# Altium schematic sheet Busbar.SchDoc
size A2; SheetNumber: 1; SheetTotal: 1
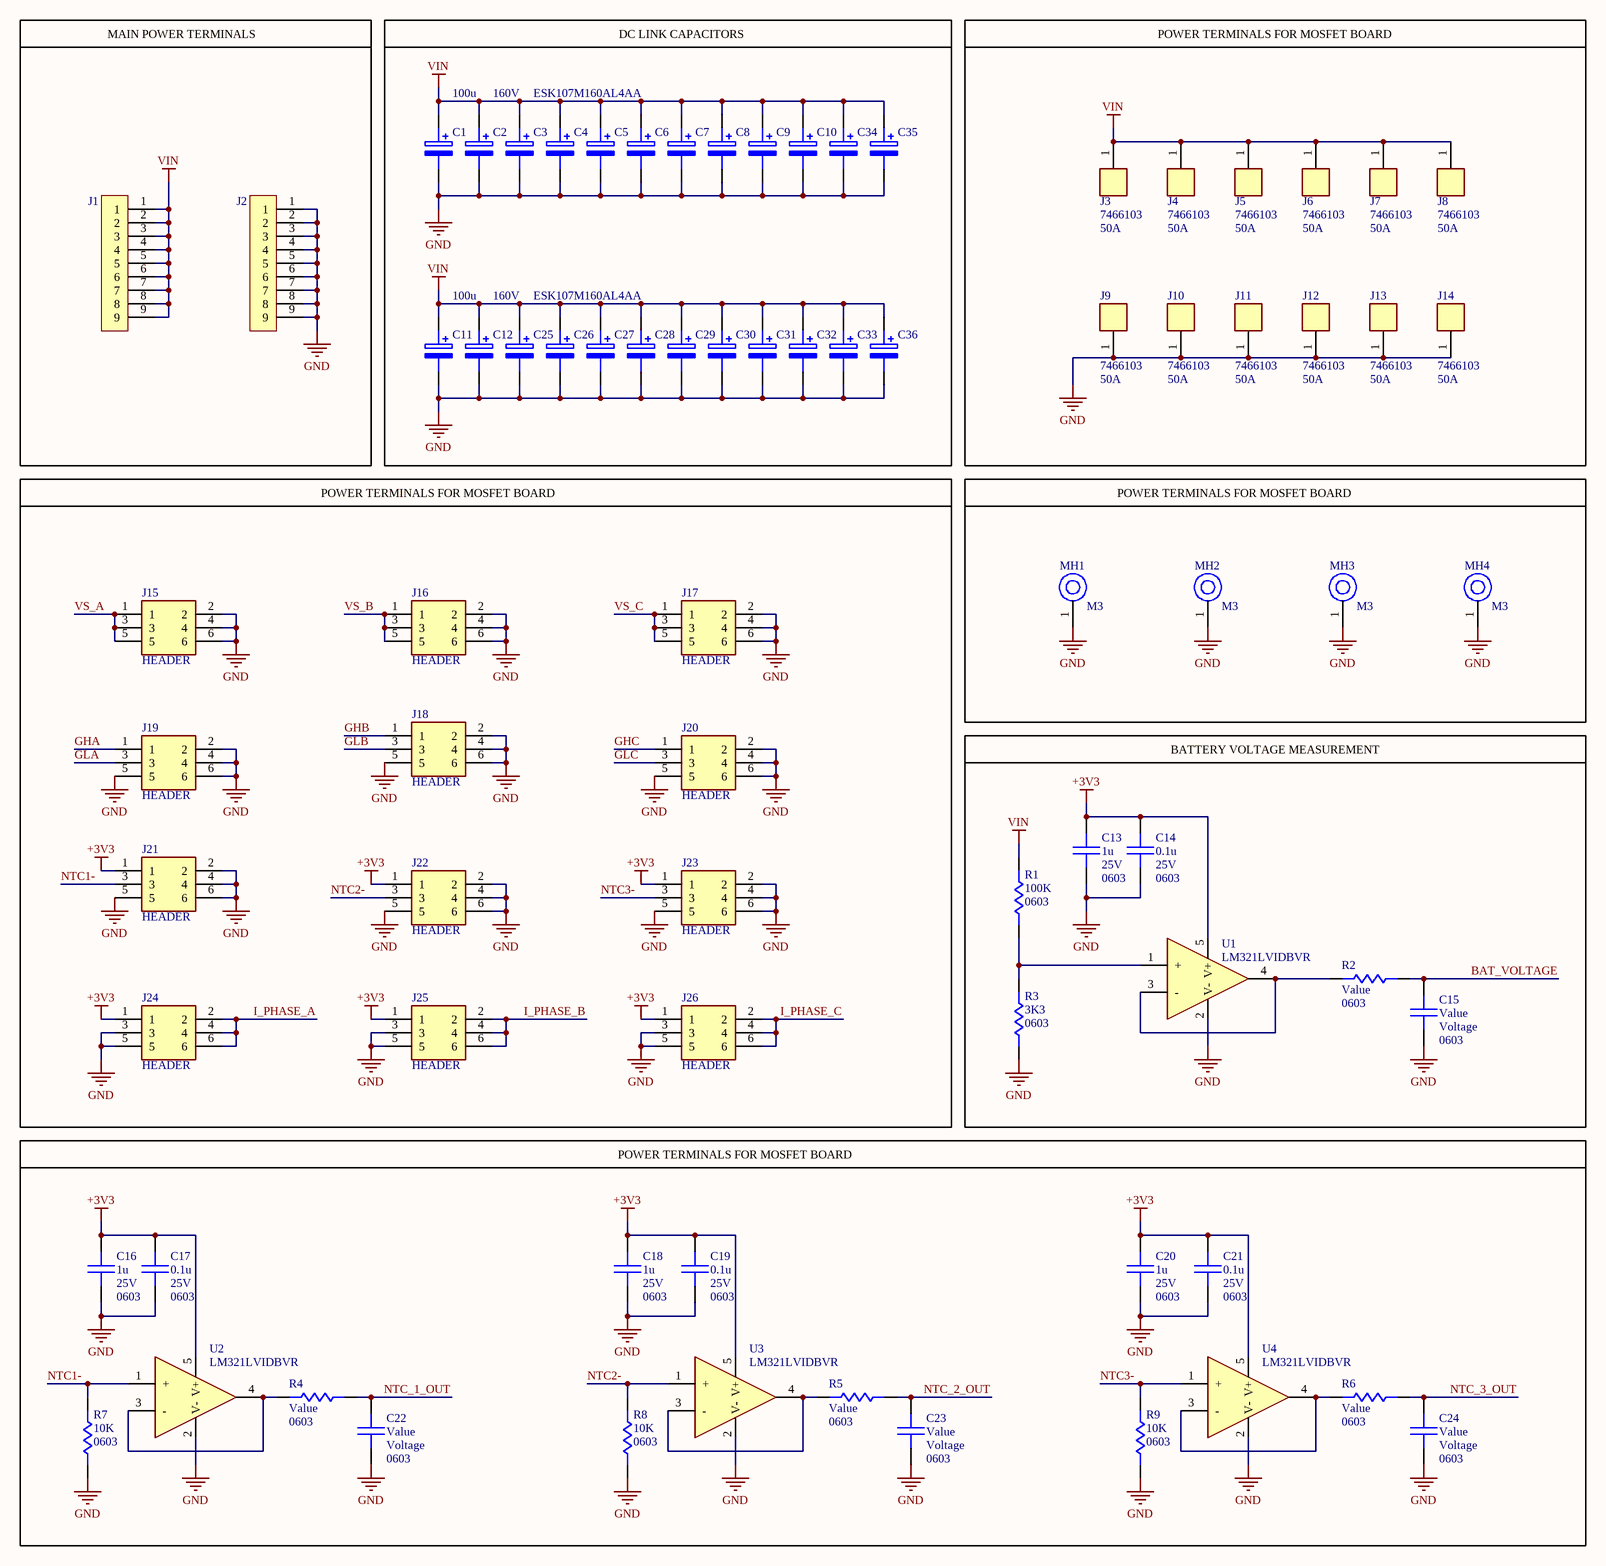
[diagram p0: Busbar.SchDoc]

## Parts
C1  ESK107M160AL4AA  value 100u  Voltage: 160V  [C_THT_13X25X5]
C2  ESK107M160AL4AA  [C_THT_13X25X5]  (value not drawn)
C3  ESK107M160AL4AA  [C_THT_13X25X5]  (value not drawn)
C4  ESK107M160AL4AA  [C_THT_13X25X5]  (value not drawn)
C5  ESK107M160AL4AA  [C_THT_13X25X5]  (value not drawn)
C6  ESK107M160AL4AA  [C_THT_13X25X5]  (value not drawn)
C7  ESK107M160AL4AA  [C_THT_13X25X5]  (value not drawn)
C8  ESK107M160AL4AA  [C_THT_13X25X5]  (value not drawn)
C9  ESK107M160AL4AA  [C_THT_13X25X5]  (value not drawn)
C10  ESK107M160AL4AA  [C_THT_13X25X5]  (value not drawn)
C11  ESK107M160AL4AA  value 100u  Voltage: 160V  [C_THT_13X25X5]
C12  ESK107M160AL4AA  [C_THT_13X25X5]  (value not drawn)
C13  0603  value 1u  Voltage: 25V  [C_0603]
C14  0603  value 0.1u  Voltage: 25V  [C_0603]
C15  0603  [C_0603]
C16  0603  value 1u  Voltage: 25V  [C_0603]
C17  0603  value 0.1u  Voltage: 25V  [C_0603]
C18  0603  value 1u  Voltage: 25V  [C_0603]
C19  0603  value 0.1u  Voltage: 25V  [C_0603]
C20  0603  value 1u  Voltage: 25V  [C_0603]
C21  0603  value 0.1u  Voltage: 25V  [C_0603]
C22  0603  [C_0603]
C23  0603  [C_0603]
C24  0603  [C_0603]
C25  ESK107M160AL4AA  [C_THT_13X25X5]  (value not drawn)
C26  ESK107M160AL4AA  [C_THT_13X25X5]  (value not drawn)
C27  ESK107M160AL4AA  [C_THT_13X25X5]  (value not drawn)
C28  ESK107M160AL4AA  [C_THT_13X25X5]  (value not drawn)
C29  ESK107M160AL4AA  [C_THT_13X25X5]  (value not drawn)
C30  ESK107M160AL4AA  [C_THT_13X25X5]  (value not drawn)
C31  ESK107M160AL4AA  [C_THT_13X25X5]  (value not drawn)
C32  ESK107M160AL4AA  [C_THT_13X25X5]  (value not drawn)
C33  ESK107M160AL4AA  [C_THT_13X25X5]  (value not drawn)
C34  ESK107M160AL4AA  [C_THT_13X25X5]  (value not drawn)
C35  ESK107M160AL4AA  [C_THT_13X25X5]  (value not drawn)
C36  ESK107M160AL4AA  [C_THT_13X25X5]  (value not drawn)
J1  74651195R  [74651195R]  (value not drawn)
J2  74651195R  [74651195R]  (value not drawn)
J3  7466103  Current: 50A  [PAD_D8.2_H3.4]
J4  7466103  Current: 50A  [PAD_D8.2_H3.4]
J5  7466103  Current: 50A  [PAD_D8.2_H3.4]
J6  7466103  Current: 50A  [PAD_D8.2_H3.4]
J7  7466103  Current: 50A  [PAD_D8.2_H3.4]
J8  7466103  Current: 50A  [PAD_D8.2_H3.4]
J9  7466103  Current: 50A  [PAD_D8.2_H3.4]
J10  7466103  Current: 50A  [PAD_D8.2_H3.4]
J11  7466103  Current: 50A  [PAD_D8.2_H3.4]
J12  7466103  Current: 50A  [PAD_D8.2_H3.4]
J13  7466103  Current: 50A  [PAD_D8.2_H3.4]
J14  7466103  Current: 50A  [PAD_D8.2_H3.4]
J15  HEADER  [HEADER_FEMALE_SMD_2X3_1.27MM]
J16  HEADER  [HEADER_FEMALE_SMD_2X3_1.27MM]
J17  HEADER  [HEADER_FEMALE_SMD_2X3_1.27MM]
J18  HEADER  [HEADER_FEMALE_SMD_2X3_1.27MM]
J19  HEADER  [HEADER_FEMALE_SMD_2X3_1.27MM]
J20  HEADER  [HEADER_FEMALE_SMD_2X3_1.27MM]
J21  HEADER  [HEADER_FEMALE_SMD_2X3_1.27MM]
J22  HEADER  [HEADER_FEMALE_SMD_2X3_1.27MM]
J23  HEADER  [HEADER_FEMALE_SMD_2X3_1.27MM]
J24  HEADER  [HEADER_FEMALE_SMD_2X3_1.27MM]
J25  HEADER  [HEADER_FEMALE_SMD_2X3_1.27MM]
J26  HEADER  [HEADER_FEMALE_SMD_2X3_1.27MM]
MH1  M3  [MOUNTING_HOLE_M3]
MH2  M3  [MOUNTING_HOLE_M3]
MH3  M3  [MOUNTING_HOLE_M3]
MH4  M3  [MOUNTING_HOLE_M3]
R1  0603  value 100K  [R_0603]
R2  0603  [R_0603]
R3  0603  value 3K3  [R_0603]
R4  0603  [R_0603]
R5  0603  [R_0603]
R6  0603  [R_0603]
R7  0603  value 10K  [R_0603]
R8  0603  value 10K  [R_0603]
R9  0603  value 10K  [R_0603]
U1  LM321LVIDBVR  [SOT23-5]
U2  LM321LVIDBVR  [SOT23-5]
U3  LM321LVIDBVR  [SOT23-5]
U4  LM321LVIDBVR  [SOT23-5]

## Blocks framed on the sheet
MAIN POWER TERMINALS: J1 J2
DC LINK CAPACITORS: C1-C12 C25-C36
POWER TERMINALS FOR MOSFET BOARD: J3-J14
POWER TERMINALS FOR MOSFET BOARD: J15-J26
POWER TERMINALS FOR MOSFET BOARD: MH1-MH4
BATTERY VOLTAGE MEASUREMENT: C13-C15 R1-R3 U1
POWER TERMINALS FOR MOSFET BOARD: C16-C24 R4-R9 U2-U4

## Nets
+3V3: C13.1 C14.1 C16.1 C17.1 C18.1 C19.1 C20.1 C21.1 J21.1 J22.1 J23.1 J24.1 J25.1 J26.1 U1.5(V+) U2.5(V+) U3.5(V+) U4.5(V+)
GND: C1.2(-) C2.2(-) C3.2(-) C4.2(-) C5.2(-) C6.2(-) C7.2(-) C8.2(-) C9.2(-) C10.2(-) C11.2(-) C12.2(-) C13.2 C14.2 C15.2 C16.2 C17.2 C18.2 C19.2 C20.2 C21.2 C22.2 C23.2 C24.2 C25.2(-) C26.2(-) C27.2(-) C28.2(-) C29.2(-) C30.2(-) C31.2(-) C32.2(-) C33.2(-) C34.2(-) C35.2(-) C36.2(-) J2.1 J2.2 J2.3 J2.4 J2.5 J2.6 J2.7 J2.8 J2.9 J9.1 J10.1 J11.1 J12.1 J13.1 J14.1 J15.2 J15.4 J15.6 J16.2 J16.4 J16.6 J17.2 J17.4 J17.6 J18.2 J18.4 J18.5 J18.6 J19.2 J19.4 J19.5 J19.6 J20.2 J20.4 J20.5 J20.6 J21.2 J21.4 J21.5 J21.6 J22.2 J22.4 J22.5 J22.6 J23.2 J23.4 J23.5 J23.6 J24.3 J24.5 J25.3 J25.5 J26.3 J26.5 MH1.1 MH2.1 MH3.1 MH4.1 R3.1 R7.1 R8.1 R9.1 U1.2(V-) U2.2(V-) U3.2(V-) U4.2(V-)
VIN: C1.1(+) C2.1(+) C3.1(+) C4.1(+) C5.1(+) C6.1(+) C7.1(+) C8.1(+) C9.1(+) C10.1(+) C11.1(+) C12.1(+) C25.1(+) C26.1(+) C27.1(+) C28.1(+) C29.1(+) C30.1(+) C31.1(+) C32.1(+) C33.1(+) C34.1(+) C35.1(+) C36.1(+) J1.1 J1.2 J1.3 J1.4 J1.5 J1.6 J1.7 J1.8 J1.9 J3.1 J4.1 J5.1 J6.1 J7.1 J8.1 R1.2
BAT_VOLTAGE: C15.1 R2.2
GHA: J19.1
GHB: J18.1
GHC: J20.1
GLA: J19.3
GLB: J18.3
GLC: J20.3
I_PHASE_A: J24.2 J24.4 J24.6
I_PHASE_B: J25.2 J25.4 J25.6
I_PHASE_C: J26.2 J26.4 J26.6
NTC1-: J21.3 R7.2 U2.1(+)
NTC2-: J22.3 R8.2 U3.1(+)
NTC3-: J23.3 R9.2 U4.1(+)
NTC_1_OUT: C22.1 R4.2
NTC_2_OUT: C23.1 R5.2
NTC_3_OUT: C24.1 R6.2
VS_A: J15.1 J15.3 J15.5
VS_B: J16.1 J16.3 J16.5
VS_C: J17.1 J17.3 J17.5
NetR1_1: R1.1 R3.2 U1.1(+)
NetR2_1: R2.1 U1.3(-) U1.4(OUT)
NetR4_1: R4.1 U2.3(-) U2.4(OUT)
NetR5_1: R5.1 U3.3(-) U3.4(OUT)
NetR6_1: R6.1 U4.3(-) U4.4(OUT)

## Library data of the parts
C1 C11 = CAP_POL_THT_100u_160V: Capacitor Polarised; ComponentLink1Description: New link; ComponentLink1URL: https://www.mouser.com.tr/ProductDetail/KEMET/ESK107M160AL4AA?qs=gt1LBUVyoHn74e7F9%2F5Ihw%3D%3D
C2-C10 C12 C25-C36 = CAP_POL_THT_100u_160V: Capacitor Polarised; Value: 100u; Voltage: 160V; ComponentLink1Description: New link; ComponentLink1URL: https://www.mouser.com.tr/ProductDetail/KEMET/ESK107M160AL4AA?qs=gt1LBUVyoHn74e7F9%2F5Ihw%3D%3D
C13-C24 = CAP_0603: SMD Chip Capacitor - 0603; ComponentLink1Description: Link; ComponentLink1URL: *
  C15 C22-C24: Voltage: Voltage; Value: Value
J1 J2 = TERMINAL_74651195R: Terminals M5-13mm 85A; ComponentLink1Description: New link; ComponentLink1URL: https://www.mouser.com.tr/ProductDetail/Wurth-Elektronik/74651195R?qs=lBTPRtX1sU%252BvmxiYHcgAuw%3D%3D
J3-J14 = TERMINAL_7466203: Terminals, SMT, M3 Thread, 50A; ComponentLink1Description: New link; ComponentLink1URL: https://www.mouser.com.tr/ProductDetail/Wurth-Elektronik/7466203?qs=IfoubJuuTRb774UUJ30heA%3D%3D
J15-J26 = HEADER_SMD_2X3_1.27MM
MH1-MH4 = Mounting_Hole_M3: M3 Mounting Hole
R1 R3 R7-R9 = RES_0603: SMD Chip Resistor - 0603; Tolerance: %1; ComponentLink1Description: Link; ComponentLink1URL: *; Watt: *
R2 R4-R6 = RES_0603: SMD Chip Resistor - 0603; ComponentLink1Description: Link; ComponentLink1URL: *; Tolerance: ?; Watt: *; Value: Value
U1-U4 = OPAMP_LM321LVIDBVR: Operational Amplifiers, Single 5.5-V, 1-MHz, 3-mV Offset Voltage; ComponentLink1Description: New link; ComponentLink1URL: https://www.mouser.com.tr/ProductDetail/Texas-Instruments/LM321LVIDBVR?qs=qSfuJ%252Bfl%2Fd66sZ569ResAQ%3D%3D